# Altium schematic sheet Sheet_1.schdoc
size 208 x 68 mm
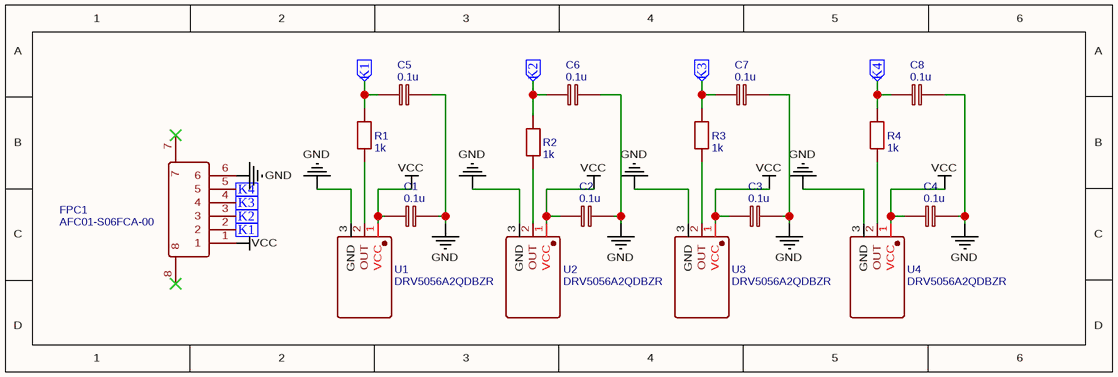
[diagram p0: Sheet_1.schdoc]

## Parts
C1  0.1u  [C0603]
C2  0.1u  [C0603]
C3  0.1u  [C0603]
C4  0.1u  [C0603]
C5  0.1u  [C0603]
C6  0.1u  [C0603]
C7  0.1u  [C0603]
C8  0.1u  [C0603]
FPC1  AFC01-S06FCA-00  [FPC-SMD_P0.50-6P_AFC01-S06FCA-00]
R1  1k  [R0603]
R2  1k  [R0603]
R3  1k  [R0603]
R4  1k  [R0603]
U1  DRV5056A2QDBZR  [SOT-23_L2.9-W1.3-P1.90-LS2.4-BR]
U2  DRV5056A2QDBZR  [SOT-23_L2.9-W1.3-P1.90-LS2.4-BR]
U3  DRV5056A2QDBZR  [SOT-23_L2.9-W1.3-P1.90-LS2.4-BR]
U4  DRV5056A2QDBZR  [SOT-23_L2.9-W1.3-P1.90-LS2.4-BR]

## Ports
K1 (in), K2 (in), K3 (in), K4 (in)

## Nets
GND: C1.2 C2.2 C3.2 C4.2 C5.2 C6.2 C7.2 C8.2 FPC1.6 U1.3(GND) U2.3(GND) U3.3(GND) U4.3(GND)
VCC: C1.1 C2.1 C3.1 C4.1 FPC1.1 U1.1(VCC) U2.1(VCC) U3.1(VCC) U4.1(VCC)
K1: C5.1 FPC1.2 R1.2 ; port K1
K2: C6.1 FPC1.3 R2.2 ; port K2
K3: C7.1 FPC1.4 R3.2 ; port K3
K4: C8.1 FPC1.5 R4.2 ; port K4
NetR1_1: R1.1 U1.2(OUT)
NetR2_1: R2.1 U2.2(OUT)
NetR3_1: R3.1 U3.2(OUT)
NetR4_1: R4.1 U4.2(OUT)

Not connected (* = marked no-connect by the designer): FPC1 7* 8*

## Library data of the parts
C1-C8 = 0.1u: nameAlias: Value(F); Contributor: LCEDA_Lib; spicePre: C; spiceSymbolName: C_0603_EU
FPC1 = AFC01-S06FCA-00: BOM_Manufacturer: JS(钜硕电子); Contributor: LCSC; BOM_Supplier: LCSC; BOM_Supplier Part: C262655; BOM_Manufacturer Part: AFC01-S06FCA-00; BOM_JLCPCB Part Class: Extended Part; spicePre: F; spiceSymbolName: AFC01-S06FCA-00
R1-R4 = 1k: nameAlias: Value(Ω); Contributor: LCEDA_Lib; spicePre: R; spiceSymbolName: R_0603_EU
U1-U4 = DRV5056A2QDBZR: BOM_Manufacturer: TI(德州仪器); Contributor: LCSC; BOM_Supplier: LCSC; BOM_Supplier Part: C266137; BOM_Manufacturer Part: DRV5056A2QDBZR; BOM_JLCPCB Part Class: Extended Part; spicePre: U; spiceSymbolName: DRV5056A2QDBZR